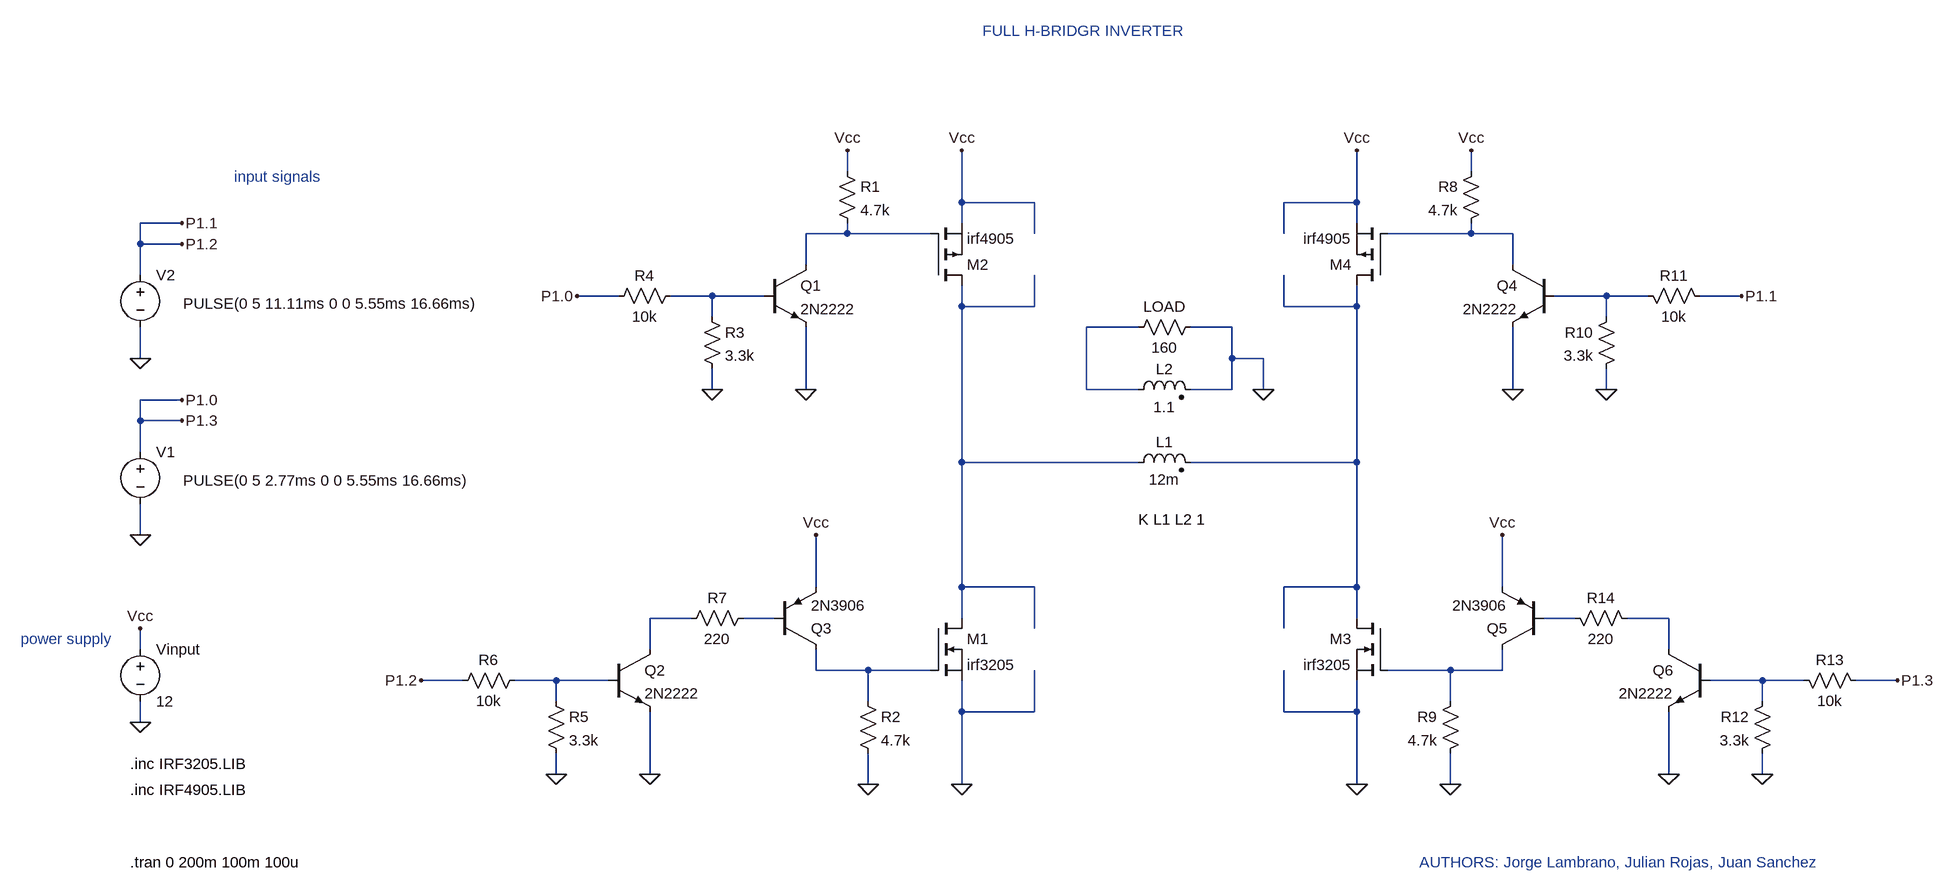
[diagram p0: schematic inverter.asc]
inverter.asc, the LTspice schematic file:
Version 4
SHEET 1 2068 936
WIRE 288 -144 288 -176
WIRE 1248 -144 1248 -176
WIRE 464 -96 464 -176
WIRE 576 -96 464 -96
WIRE 1072 -96 1072 -176
WIRE 1072 -96 960 -96
WIRE -736 -64 -800 -64
WIRE 464 -64 464 -96
WIRE 1072 -64 1072 -96
WIRE 288 -48 288 -64
WIRE 288 -48 224 -48
WIRE 416 -48 288 -48
WIRE 576 -48 576 -96
WIRE 960 -48 960 -96
WIRE 1248 -48 1248 -64
WIRE 1248 -48 1120 -48
WIRE 1312 -48 1248 -48
WIRE -800 -32 -800 -64
WIRE -736 -32 -800 -32
WIRE 224 0 224 -48
WIRE 1312 0 1312 -48
WIRE -800 16 -800 -32
WIRE -64 48 -128 48
WIRE 80 48 16 48
WIRE 160 48 80 48
WIRE 1456 48 1376 48
WIRE 1520 48 1456 48
WIRE 1664 48 1600 48
WIRE 464 64 464 32
WIRE 576 64 576 16
WIRE 576 64 464 64
WIRE 960 64 960 16
WIRE 1072 64 1072 32
WIRE 1072 64 960 64
WIRE 80 80 80 48
WIRE 1456 80 1456 48
WIRE 736 96 656 96
WIRE 880 96 816 96
WIRE -800 144 -800 96
WIRE 880 144 880 96
WIRE 928 144 880 144
WIRE 80 192 80 160
WIRE 224 192 224 96
WIRE 656 192 656 96
WIRE 736 192 656 192
WIRE 880 192 880 144
WIRE 880 192 816 192
WIRE 928 192 928 144
WIRE 1312 192 1312 96
WIRE 1456 192 1456 160
WIRE -736 208 -800 208
WIRE -800 240 -800 208
WIRE -736 240 -800 240
WIRE -800 288 -800 240
WIRE 464 304 464 64
WIRE 736 304 464 304
WIRE 1072 304 1072 64
WIRE 1072 304 816 304
WIRE -800 416 -800 368
WIRE 240 496 240 416
WIRE 464 496 464 304
WIRE 576 496 464 496
WIRE 1072 496 1072 304
WIRE 1072 496 960 496
WIRE 1296 496 1296 416
WIRE 48 544 -16 544
WIRE 176 544 128 544
WIRE 464 544 464 496
WIRE 1072 544 1072 496
WIRE 1408 544 1360 544
WIRE 1552 544 1488 544
WIRE 576 560 576 496
WIRE 960 560 960 496
WIRE -800 592 -800 560
WIRE -16 592 -16 544
WIRE 1552 592 1552 544
WIRE 240 624 240 592
WIRE 320 624 240 624
WIRE 416 624 320 624
WIRE 1216 624 1120 624
WIRE 1296 624 1296 592
WIRE 1296 624 1216 624
WIRE -304 640 -368 640
WIRE -160 640 -224 640
WIRE -80 640 -160 640
WIRE 1696 640 1616 640
WIRE 1760 640 1696 640
WIRE 1904 640 1840 640
WIRE -160 672 -160 640
WIRE 320 672 320 624
WIRE 1216 672 1216 624
WIRE 1696 672 1696 640
WIRE 464 688 464 640
WIRE 576 688 576 624
WIRE 576 688 464 688
WIRE 960 688 960 624
WIRE 1072 688 1072 640
WIRE 1072 688 960 688
WIRE -800 704 -800 672
WIRE -160 784 -160 752
WIRE -16 784 -16 688
WIRE 1552 784 1552 688
WIRE 1696 784 1696 752
WIRE 320 800 320 752
WIRE 464 800 464 688
WIRE 1072 800 1072 688
WIRE 1216 800 1216 752
FLAG -800 560 Vcc
FLAG -800 704 0
FLAG 80 192 0
FLAG 224 192 0
FLAG 288 -176 Vcc
FLAG 464 -176 Vcc
FLAG -128 48 P1.0
FLAG -160 784 0
FLAG -16 784 0
FLAG -368 640 P1.2
FLAG 240 416 Vcc
FLAG 320 800 0
FLAG 464 800 0
FLAG 1456 192 0
FLAG 1312 192 0
FLAG 1248 -176 Vcc
FLAG 1072 -176 Vcc
FLAG 1664 48 P1.1
FLAG 1696 784 0
FLAG 1552 784 0
FLAG 1904 640 P1.3
FLAG 1296 416 Vcc
FLAG 1216 800 0
FLAG 1072 800 0
FLAG -800 416 0
FLAG -736 208 P1.0
FLAG -736 240 P1.3
FLAG -800 144 0
FLAG -736 -64 P1.1
FLAG -736 -32 P1.2
FLAG 928 192 0
SYMBOL res 720 112 R270
WINDOW 0 32 56 VTop 2
WINDOW 3 0 56 VBottom 2
SYMATTR InstName LOAD
SYMATTR Value 160
SYMBOL voltage -800 576 R0
WINDOW 123 0 0 Left 2
WINDOW 39 0 0 Left 2
SYMATTR InstName Vinput
SYMATTR Value 12
SYMBOL nmos 416 544 R0
SYMATTR InstName M1
SYMATTR Value irf3205
SYMATTR Prefix X
SYMBOL res 272 -160 R0
SYMATTR InstName R1
SYMATTR Value 4.7k
SYMBOL res 304 656 R0
SYMATTR InstName R2
SYMATTR Value 4.7k
SYMBOL npn2 160 0 R0
SYMATTR InstName Q1
SYMATTR Value 2N2222
SYMBOL res 64 64 R0
SYMATTR InstName R3
SYMATTR Value 3.3k
SYMBOL res -80 64 R270
WINDOW 0 32 56 VTop 2
WINDOW 3 0 56 VBottom 2
SYMATTR InstName R4
SYMATTR Value 10k
SYMBOL pnp 176 592 M180
SYMATTR InstName Q3
SYMATTR Value 2N3906
SYMBOL npn2 -80 592 R0
SYMATTR InstName Q2
SYMATTR Value 2N2222
SYMBOL res -176 656 R0
SYMATTR InstName R5
SYMATTR Value 3.3k
SYMBOL res -320 656 R270
WINDOW 0 32 56 VTop 2
WINDOW 3 0 56 VBottom 2
SYMATTR InstName R6
SYMATTR Value 10k
SYMBOL res 32 560 R270
WINDOW 0 32 56 VTop 2
WINDOW 3 0 56 VBottom 2
SYMATTR InstName R7
SYMATTR Value 220
SYMBOL pmos 1120 32 R180
SYMATTR InstName M4
SYMATTR Value irf4905
SYMATTR Prefix X
SYMBOL res 1264 -160 M0
SYMATTR InstName R8
SYMATTR Value 4.7k
SYMBOL res 1232 656 M0
SYMATTR InstName R9
SYMATTR Value 4.7k
SYMBOL npn2 1376 0 M0
SYMATTR InstName Q4
SYMATTR Value 2N2222
SYMBOL res 1472 64 M0
SYMATTR InstName R10
SYMATTR Value 3.3k
SYMBOL res 1616 64 M270
WINDOW 0 32 56 VTop 2
WINDOW 3 0 56 VBottom 2
SYMATTR InstName R11
SYMATTR Value 10k
SYMBOL pnp 1360 592 R180
SYMATTR InstName Q5
SYMATTR Value 2N3906
SYMBOL npn2 1616 592 M0
SYMATTR InstName Q6
SYMATTR Value 2N2222
SYMBOL res 1712 656 M0
SYMATTR InstName R12
SYMATTR Value 3.3k
SYMBOL res 1856 656 M270
WINDOW 0 32 56 VTop 2
WINDOW 3 0 56 VBottom 2
SYMATTR InstName R13
SYMATTR Value 10k
SYMBOL res 1504 560 M270
WINDOW 0 32 56 VTop 2
WINDOW 3 0 56 VBottom 2
SYMATTR InstName R14
SYMATTR Value 220
SYMBOL ind2 720 320 R270
WINDOW 0 32 56 VTop 2
WINDOW 3 5 56 VBottom 2
SYMATTR InstName L1
SYMATTR Value 12m
SYMATTR Type ind
SYMBOL ind2 720 208 R270
WINDOW 0 32 56 VTop 2
WINDOW 3 5 56 VBottom 2
SYMATTR InstName L2
SYMATTR Value 1.1
SYMATTR Type ind
SYMBOL pmos 416 32 M180
SYMATTR InstName M2
SYMATTR Value irf4905
SYMATTR Prefix X
SYMBOL nmos 1120 544 M0
SYMATTR InstName M3
SYMATTR Value irf3205
SYMATTR Prefix X
SYMBOL voltage -800 272 R0
WINDOW 3 66 60 Left 2
WINDOW 123 0 0 Left 2
WINDOW 39 0 0 Left 2
SYMATTR Value PULSE(0 5 2.77ms 0 0 5.55ms 16.66ms)
SYMATTR InstName V1
SYMBOL voltage -800 0 R0
WINDOW 3 66 60 Left 2
WINDOW 123 0 0 Left 2
WINDOW 39 0 0 Left 2
SYMATTR Value PULSE(0 5 11.11ms 0 0 5.55ms 16.66ms)
SYMATTR InstName V2
TEXT -816 808 Left 2 !.inc IRF4905.LIB
TEXT -984 576 Left 2 ;power supply
TEXT 496 -360 Left 2 ;FULL H-BRIDGR INVERTER
TEXT 736 392 Left 2 !K L1 L2 1
TEXT -656 -136 Left 2 ;input signals
TEXT -816 920 Left 2 !.tran 0 200m 100m 100u
TEXT -816 768 Left 2 !.inc IRF3205.LIB
TEXT 1168 920 Left 2 ;AUTHORS: Jorge Lambrano, Julian Rojas, Juan Sanchez

The netlist it stands for:
* inverter.asc
R§LOAD N007 0 160
Vinput Vcc 0 12
XM1 N005 N012 0 irf3205  ; pins D G S
R1 Vcc N001 4.7k
R2 N012 0 4.7k
Q1 N001 N003 0 0 2N2222
R3 N003 0 3.3k
R4 P1.3 N003 10k
Q3 N012 N009 Vcc 0 2N3906
Q2 N008 N014 0 0 2N2222
R5 N014 0 3.3k
R6 P1.1 N014 10k
R7 N008 N009 220
XM4 N006 N002 Vcc irf4905  ; pins D G S
R8 Vcc N002 4.7k
R9 N013 0 4.7k
Q4 N002 N004 0 0 2N2222
R10 N004 0 3.3k
R11 P1.1 N004 10k
Q5 N013 N010 Vcc 0 2N3906
Q6 N011 N015 0 0 2N2222
R12 N015 0 3.3k
R13 P1.3 N015 10k
R14 N011 N010 220
L1 N005 N006 12m
L2 N007 0 1.1
XM2 N005 N001 Vcc irf4905  ; pins D G S
XM3 N006 N013 0 irf3205  ; pins D G S
V1 P1.3 0 PULSE(0 5 2.77ms 0 0 5.55ms 16.66ms)
V2 P1.1 0 PULSE(0 5 11.11ms 0 0 5.55ms 16.66ms)
.model NPN NPN
.model PNP PNP
.lib standard.bjt
.inc IRF4905.LIB
* power supply
* FULL H-BRIDGR INVERTER
K L1 L2 1
* input signals
.tran 0 200m 100m 100u
.inc IRF3205.LIB
* AUTHORS: Jorge Lambrano, Julian Rojas, Juan Sanchez
.backanno
.end